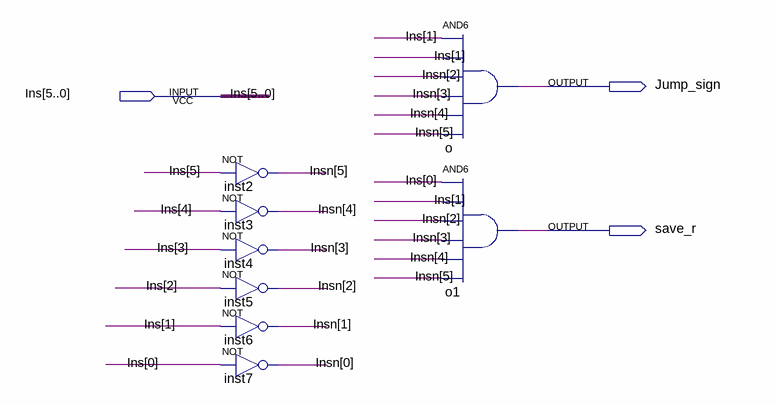
[diagram p0: schematic sheet]
// Quartus schematic ControlJump.bdf as structural Verilog: 8 symbols, 3 pins
module ControlJump (
  input  [5:0] Ins,
  output Jump_sign,
  output save_r
);

  wire [5:0] Insn;

  not inst2 (Insn[5], Ins[5]);
  not inst3 (Insn[4], Ins[4]);
  not inst4 (Insn[3], Ins[3]);
  not inst5 (Insn[2], Ins[2]);
  not inst6 (Insn[1], Ins[1]);
  not inst7 (Insn[0], Ins[0]);
  and o (Jump_sign, Ins[1], Ins[1], Insn[2], Insn[3], Insn[4], Insn[5]);
  and o1 (save_r, Ins[0], Ins[1], Insn[2], Insn[3], Insn[4], Insn[5]);
endmodule
